# Altium schematic sheet work.SchDoc: TouchPad Demo
size 228 x 281 mm; DrawnBy: Analog Dragon
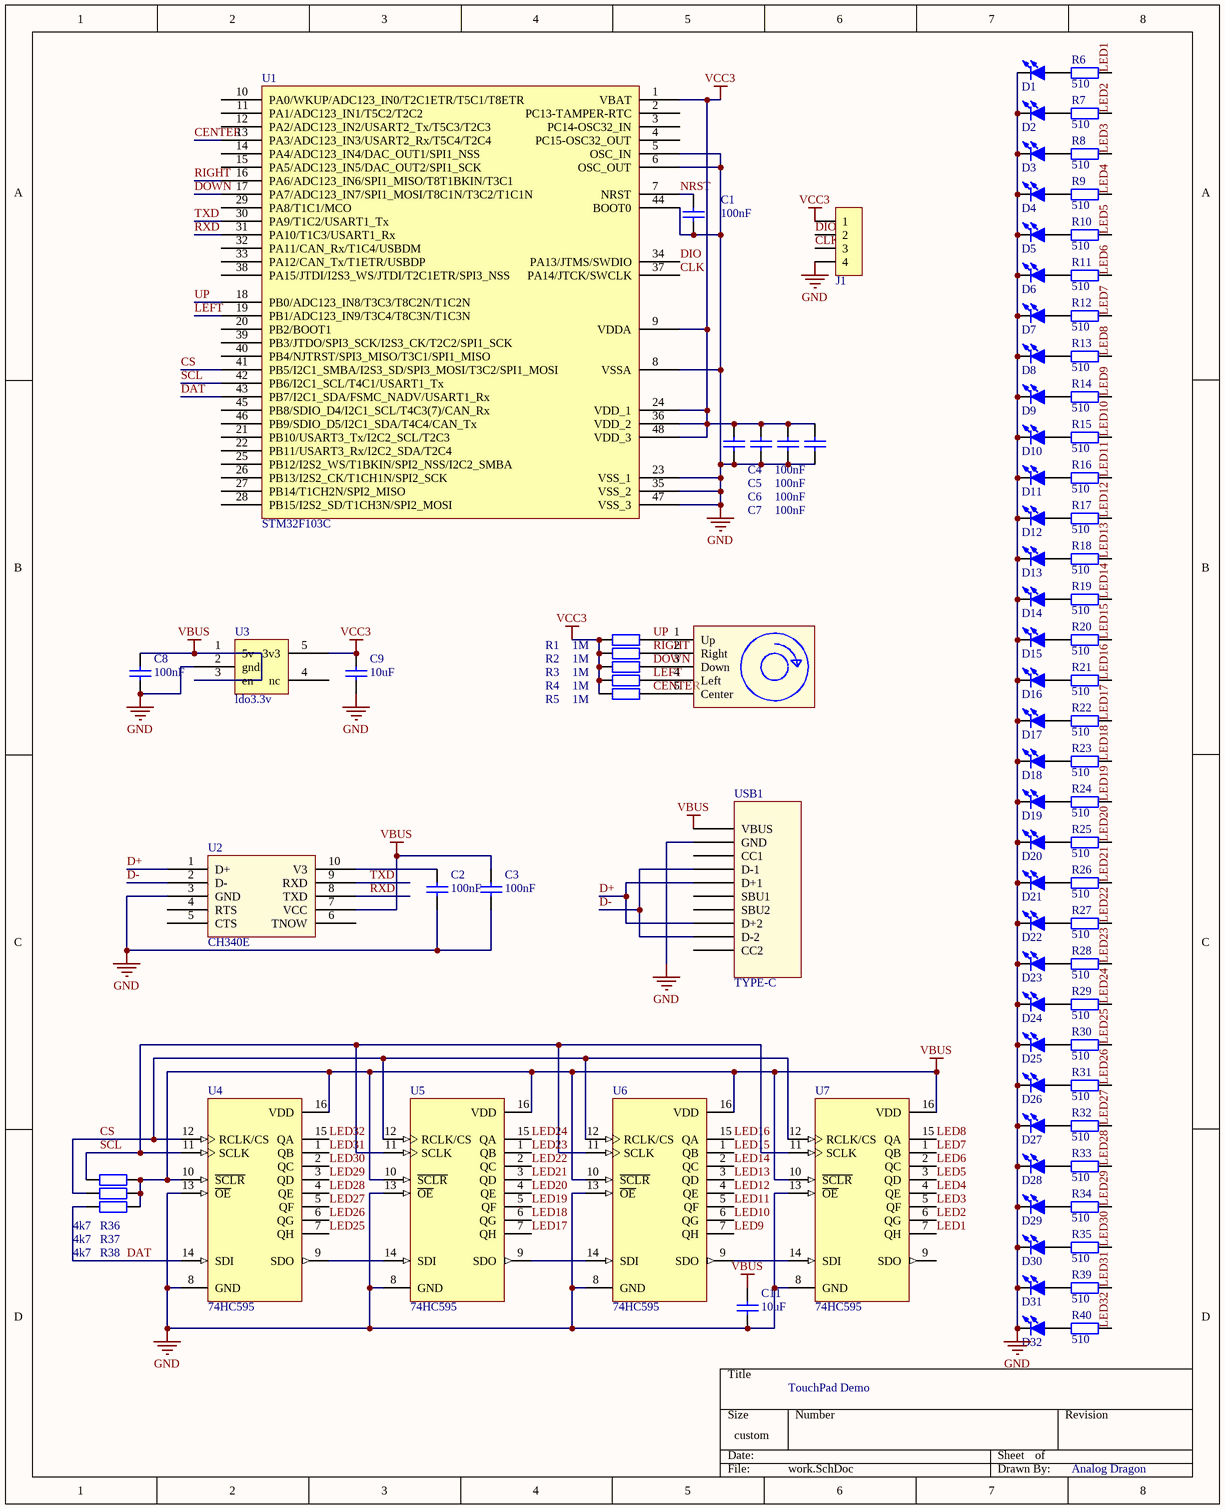
[diagram p0: work.SchDoc]

## Parts
*1  TouchPad-R  [TouchPad-R]  (value not drawn)
C1  value 100nF  [C-RAD-0603]  (hidden comment: Cap)
C2  value 100nF  [C-RAD-0603]  (hidden comment: Cap)
C3  value 100nF  [C-RAD-0603]  (hidden comment: Cap)
C4  value 100nF  [C-RAD-0603]  (hidden comment: Cap)
C5  value 100nF  [C-RAD-0603]  (hidden comment: Cap)
C6  value 100nF  [C-RAD-0603]  (hidden comment: Cap)
C7  value 100nF  [C-RAD-0603]  (hidden comment: Cap)
C8  value 100nF  [C-RAD-3528]  (hidden comment: Cap)
C9  value 10uF  [C-RAD-0805]  (hidden comment: Cap)
C11  value 10uF  [C-RAD-0805]  (hidden comment: Cap)
D1  (no value)  [LED 0805W]
D2  (no value)  [LED 0805W]
D3  (no value)  [LED 0805W]
D4  (no value)  [LED 0805W]
D5  (no value)  [LED 0805W]
D6  (no value)  [LED 0805W]
D7  (no value)  [LED 0805W]
D8  (no value)  [LED 0805W]
D9  (no value)  [LED 0805W]
D10  (no value)  [LED 0805W]
D11  (no value)  [LED 0805W]
D12  (no value)  [LED 0805W]
D13  (no value)  [LED 0805W]
D14  (no value)  [LED 0805W]
D15  (no value)  [LED 0805W]
D16  (no value)  [LED 0805W]
D17  (no value)  [LED 0805W]
D18  (no value)  [LED 0805W]
D19  (no value)  [LED 0805W]
D20  (no value)  [LED 0805W]
D21  (no value)  [LED 0805W]
D22  (no value)  [LED 0805W]
D23  (no value)  [LED 0805W]
D24  (no value)  [LED 0805W]
D25  (no value)  [LED 0805W]
D26  (no value)  [LED 0805W]
D27  (no value)  [LED 0805W]
D28  (no value)  [LED 0805W]
D29  (no value)  [LED 0805W]
D30  (no value)  [LED 0805W]
D31  (no value)  [LED 0805W]
D32  (no value)  [LED 0805W]
J1  HDR-1X4  [HDR2.0-LI-4P]  (value not drawn)
R1  value 1M  [0603-1]  (hidden comment: Res1)
R2  value 1M  [0603-1]  (hidden comment: Res1)
R3  value 1M  [0603-1]  (hidden comment: Res1)
R4  value 1M  [0603-1]  (hidden comment: Res1)
R5  value 1M  [0603-1]  (hidden comment: Res1)
R6  value 510  [0603-1]  (hidden comment: Res1)
R7  value 510  [0603-1]  (hidden comment: Res1)
R8  value 510  [0603-1]  (hidden comment: Res1)
R9  value 510  [0603-1]  (hidden comment: Res1)
R10  value 510  [0603-1]  (hidden comment: Res1)
R11  value 510  [0603-1]  (hidden comment: Res1)
R12  value 510  [0603-1]  (hidden comment: Res1)
R13  value 510  [0603-1]  (hidden comment: Res1)
R14  value 510  [0603-1]  (hidden comment: Res1)
R15  value 510  [0603-1]  (hidden comment: Res1)
R16  value 510  [0603-1]  (hidden comment: Res1)
R17  value 510  [0603-1]  (hidden comment: Res1)
R18  value 510  [0603-1]  (hidden comment: Res1)
R19  value 510  [0603-1]  (hidden comment: Res1)
R20  value 510  [0603-1]  (hidden comment: Res1)
R21  value 510  [0603-1]  (hidden comment: Res1)
R22  value 510  [0603-1]  (hidden comment: Res1)
R23  value 510  [0603-1]  (hidden comment: Res1)
R24  value 510  [0603-1]  (hidden comment: Res1)
R25  value 510  [0603-1]  (hidden comment: Res1)
R26  value 510  [0603-1]  (hidden comment: Res1)
R27  value 510  [0603-1]  (hidden comment: Res1)
R28  value 510  [0603-1]  (hidden comment: Res1)
R29  value 510  [0603-1]  (hidden comment: Res1)
R30  value 510  [0603-1]  (hidden comment: Res1)
R31  value 510  [0603-1]  (hidden comment: Res1)
R32  value 510  [0603-1]  (hidden comment: Res1)
R33  value 510  [0603-1]  (hidden comment: Res1)
R34  value 510  [0603-1]  (hidden comment: Res1)
R35  value 510  [0603-1]  (hidden comment: Res1)
R36  value 4k7  [0603-1]  (hidden comment: Res1)
R37  value 4k7  [0603-1]  (hidden comment: Res1)
R38  value 4k7  [0603-1]  (hidden comment: Res1)
R39  value 510  [0603-1]  (hidden comment: Res1)
R40  value 510  [0603-1]  (hidden comment: Res1)
U1  STM32F103C  [LQFP-48_M]
U2  CH340E  [MSOP10_M]
U3  ldo3.3v  [SOT23-5]
U4  74HC595  [NSO16_M]
U5  74HC595  [NSO16_M]
U6  74HC595  [NSO16_M]
U7  74HC595  [NSO16_M]
USB1  TYPE-C  [TYPE-C]

## Nets
GND: C1.1 C2.1 C3.1 C4.1 C5.1 C6.1 C7.1 C8.1 C9.1 C11.1 D1.2(K) D2.2(K) D3.2(K) D4.2(K) D5.2(K) D6.2(K) D7.2(K) D8.2(K) D9.2(K) D10.2(K) D11.2(K) D12.2(K) D13.2(K) D14.2(K) D15.2(K) D16.2(K) D17.2(K) D18.2(K) D19.2(K) D20.2(K) D21.2(K) D22.2(K) D23.2(K) D24.2(K) D25.2(K) D26.2(K) D27.2(K) D28.2(K) D29.2(K) D30.2(K) D31.2(K) D32.2(K) J1.4 U1.5(OSC_IN) U1.6(OSC_OUT) U1.8(VSSA) U1.23(VSS_1) U1.35(VSS_2) U1.44(BOOT0) U1.47(VSS_3) U2.3(GND) U3.2(gnd) U4.8(GND) U4.13(~{OE}) U5.8(GND) U5.13(~{OE}) U6.8(GND) U6.13(~{OE}) U7.8(GND) U7.13(~{OE}) USB1.GND
VBUS: C3.2 C8.2 C11.2 R36.2 R37.2 R38.2 U2.7(VCC) U3.1(5v) U3.3(en) U4.10(~{SCLR}) U4.16(VDD) U5.10(~{SCLR}) U5.16(VDD) U6.10(~{SCLR}) U6.16(VDD) U7.10(~{SCLR}) U7.16(VDD) USB1.VBUS
VCC3: C4.2 C5.2 C6.2 C7.2 C9.2 J1.1 R1.1 R2.1 R3.1 R4.1 R5.1 U1.1(VBAT) U1.9(VDDA) U1.24(VDD_1) U1.36(VDD_2) U1.48(VDD_3) U3.5(3v3)
CENTER: *1.5(Center) R5.2 U1.13(PA3/ADC123_IN3/USART2_Rx/T5C4/T2C4)
CLK: J1.3 U1.37(PA14/JTCK/SWCLK)
CS: R37.1 U1.41(PB5/I2C1_SMBA/I2S3_SD/SPI3_MOSI/T3C2/SPI1_MOSI) U4.12(RCLK/CS) U5.12(RCLK/CS) U6.12(RCLK/CS) U7.12(RCLK/CS)
D+: U2.1(D+) USB1.D+1 USB1.D+2
D-: U2.2(D-) USB1.D-1 USB1.D-2
DAT: R38.1 U1.43(PB7/I2C1_SDA/FSMC_NADV/USART1_Rx) U4.14(SDI)
DIO: J1.2 U1.34(PA13/JTMS/SWDIO)
DOWN: *1.3(Down) R3.2 U1.17(PA7/ADC123_IN7/SPI1_MOSI/T8C1N/T3C2/T1C1N)
LED1: R6.2 U7.7(QH)
LED2: R7.2 U7.6(QG)
LED3: R8.2 U7.5(QF)
LED4: R9.2 U7.4(QE)
LED5: R10.2 U7.3(QD)
LED6: R11.2 U7.2(QC)
LED7: R12.2 U7.1(QB)
LED8: R13.2 U7.15(QA)
LED9: R14.2 U6.7(QH)
LED10: R15.2 U6.6(QG)
LED11: R16.2 U6.5(QF)
LED12: R17.2 U6.4(QE)
LED13: R18.2 U6.3(QD)
LED14: R19.2 U6.2(QC)
LED15: R20.2 U6.1(QB)
LED16: R21.2 U6.15(QA)
LED17: R22.2 U5.7(QH)
LED18: R23.2 U5.6(QG)
LED19: R24.2 U5.5(QF)
LED20: R25.2 U5.4(QE)
LED21: R26.2 U5.3(QD)
LED22: R27.2 U5.2(QC)
LED23: R28.2 U5.1(QB)
LED24: R29.2 U5.15(QA)
LED25: R30.2 U4.7(QH)
LED26: R31.2 U4.6(QG)
LED27: R32.2 U4.5(QF)
LED28: R33.2 U4.4(QE)
LED29: R34.2 U4.3(QD)
LED30: R35.2 U4.2(QC)
LED31: R39.2 U4.1(QB)
LED32: R40.2 U4.15(QA)
LEFT: *1.4(Left) R4.2 U1.19(PB1/ADC123_IN9/T3C4/T8C3N/T1C3N)
NRST: C1.2 U1.7(NRST)
RIGHT: *1.2(Right) R2.2 U1.16(PA6/ADC123_IN6/SPI1_MISO/T8T1BKIN/T3C1)
RXD: U1.31(PA10/T1C3/USART1_Rx) U2.8(TXD)
SCL: R36.1 U1.42(PB6/I2C1_SCL/T4C1/USART1_Tx) U4.11(SCLK) U5.11(SCLK) U6.11(SCLK) U7.11(SCLK)
TXD: U1.30(PA9/T1C2/USART1_Tx) U2.9(RXD)
UP: *1.1(Up) R1.2 U1.18(PB0/ADC123_IN8/T3C3/T8C2N/T1C2N)
NetC2_2: C2.2 U2.10(V3)
NetD1_1: D1.1(A) R6.1
NetD2_1: D2.1(A) R7.1
NetD3_1: D3.1(A) R8.1
NetD4_1: D4.1(A) R9.1
NetD5_1: D5.1(A) R10.1
NetD6_1: D6.1(A) R11.1
NetD7_1: D7.1(A) R12.1
NetD8_1: D8.1(A) R13.1
NetD9_1: D9.1(A) R14.1
NetD10_1: D10.1(A) R15.1
NetD11_1: D11.1(A) R16.1
NetD12_1: D12.1(A) R17.1
NetD13_1: D13.1(A) R18.1
NetD14_1: D14.1(A) R19.1
NetD15_1: D15.1(A) R20.1
NetD16_1: D16.1(A) R21.1
NetD17_1: D17.1(A) R22.1
NetD18_1: D18.1(A) R23.1
NetD19_1: D19.1(A) R24.1
NetD20_1: D20.1(A) R25.1
NetD21_1: D21.1(A) R26.1
NetD22_1: D22.1(A) R27.1
NetD23_1: D23.1(A) R28.1
NetD24_1: D24.1(A) R29.1
NetD25_1: D25.1(A) R30.1
NetD26_1: D26.1(A) R31.1
NetD27_1: D27.1(A) R32.1
NetD28_1: D28.1(A) R33.1
NetD29_1: D29.1(A) R34.1
NetD30_1: D30.1(A) R35.1
NetD31_1: D31.1(A) R39.1
NetD32_1: D32.1(A) R40.1
NetU4_9: U4.9(SDO) U5.14(SDI)
NetU5_9: U5.9(SDO) U6.14(SDI)
NetU6_9: U6.9(SDO) U7.14(SDI)

Not connected (* = marked no-connect by the designer): U1 2(PC13-TAMPER-RTC) 3(PC14-OSC32_IN) 4(PC15-OSC32_OUT) 10(PA0/WKUP/ADC123_IN0/T2C1ETR/T5C1/T8ETR) 11(PA1/ADC123_IN1/T5C2/T2C2) 12(PA2/ADC123_IN2/USART2_Tx/T5C3/T2C3) 14(PA4/ADC123_IN4/DAC_OUT1/SPI1_NSS) 15(PA5/ADC123_IN5/DAC_OUT2/SPI1_SCK) 20(PB2/BOOT1) 21(PB10/USART3_Tx/I2C2_SCL/T2C3) 22(PB11/USART3_Rx/I2C2_SDA/T2C4) 25(PB12/I2S2_WS/T1BKIN/SPI2_NSS/I2C2_SMBA) 26(PB13/I2S2_CK/T1CH1N/SPI2_SCK) 27(PB14/T1CH2N/SPI2_MISO) 28(PB15/I2S2_SD/T1CH3N/SPI2_MOSI) 29(PA8/T1C1/MCO) 32(PA11/CAN_Rx/T1C4/USBDM) 33(PA12/CAN_Tx/T1ETR/USBDP) 38(PA15/JTDI/I2S3_WS/JTDI/T2C1ETR/SPI3_NSS) 39(PB3/JTDO/SPI3_SCK/I2S3_CK/T2C2/SPI1_SCK) 40(PB4/NJTRST/SPI3_MISO/T3C1/SPI1_MISO) 45(PB8/SDIO_D4/I2C1_SCL/T4C3(7)/CAN_Rx) 46(PB9/SDIO_D5/I2C1_SDA/T4C4/CAN_Tx); U2 4(RTS) 5(CTS) 6(TNOW); U3 4(nc); U7 9(SDO); USB1 CC1 SBU1 SBU2

## Library data of the parts
C1-C9 C11 = Cap: 无极性电容; Published: 8-Jun-2000; LatestRevisionDate: 17-Jul-2002; LatestRevisionNote: Re-released for DXP Platform.; PackageReference: RAD-0.3; Publisher: Altium Limited
D1-D32 = LED-SMD: 贴片LED; 版权归属: 源创客; BOM名称: 贴片LED; 学习资源: www.ooocke.com
J1 = Header 4: 4P接插件; 版权归属: 源创客; BOM名称: 4P接插件; 学习资源: www.ooocke.com
R1-R40 = Res1: 贴片电阻; Published: 8-Jun-2000; LatestRevisionDate: 17-Jul-2002; LatestRevisionNote: Re-released for DXP Platform.; PackageReference: AXIAL-0.4; Publisher: Altium Limited
U1 = STM32F103C: STM32单片机48引脚
U3 = Component_1
U4-U7 = 74HC595: 移位寄存器; ComponentAvailability: Not for New Design; Published: 15-Apr-2002; LatestRevisionDate: 13-Apr-2006; LatestRevisionNote: IPC-7351 Footprint Added.; DatasheetVersion: 1997; PackageVersion: 1997; PackageReference: 966-01; Publisher: Altium Limited; PackageDescription: 16-Pin Small Outline Package 1.27 mm Pitch; ComponentLink1Description: Manufacturer Link; ComponentLink1URL: http://www.onsemi.com/; ComponentLink2Description: Datasheet; ComponentLink2URL: http://www.onsemi.com/pub/Collateral/MC74VHC595-D.PDF
USB1 = USB-C